# EAGLE schematic Diagrama2 (EAGLE 9.4.2)
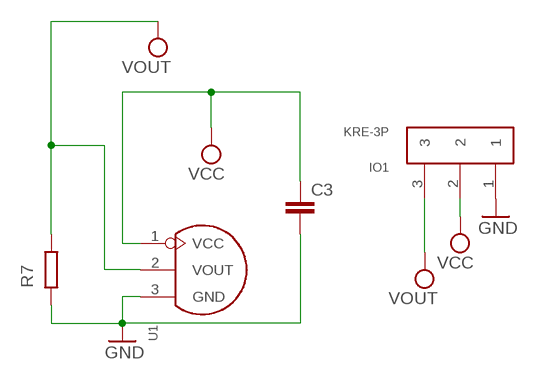
[diagram p0: schematic, sheet 1]

## Parts
C3  C-EU050-025X075  [C050-025X075]
IO1  KRE-3P  [KRE-3P]
R7  220 1/4  1K1/4RESISTOR  [1/4W-0.41K]
U1  LM35DZ  DIP-TEMPERATURE-LM35DZ(TO-92)  [TO-92]

## Nets
GND: C3.2 IO1.1 R7.1 U1.3(GND)
VCC: C3.1 IO1.2 IO1.3 R7.2 U1.1(VCC) U1.2(VOUT) ; supply symbol labelled VOUT

## Library data of the parts
C3 = rcl:C-EU: CAPACITOR, European symbol; SPICEPREFIX: C
IO1 = kre:KRE-3P: KRE Conector 3P
R7 = resistors:1K1/4RESISTOR
U1 = DIP-TEMPERATURE-LM35DZ_TO-92_:DIP-TEMPERATURE-LM35DZ(TO-92): 314010014; AVAILABILITY: Unavailable; DESCRIPTION: ?0.5?C Temperature Sensor with Analog Output with 30V Capability 3-TO-92; MF: Texas Instruments; MP: LM35DZ; PACKAGE: TO-92 Texas Instruments; PRICE: None

## Module LM1
Ports: 

### Library data of the parts